# EAGLE schematic fatteningFarm (EAGLE 9.6.2)
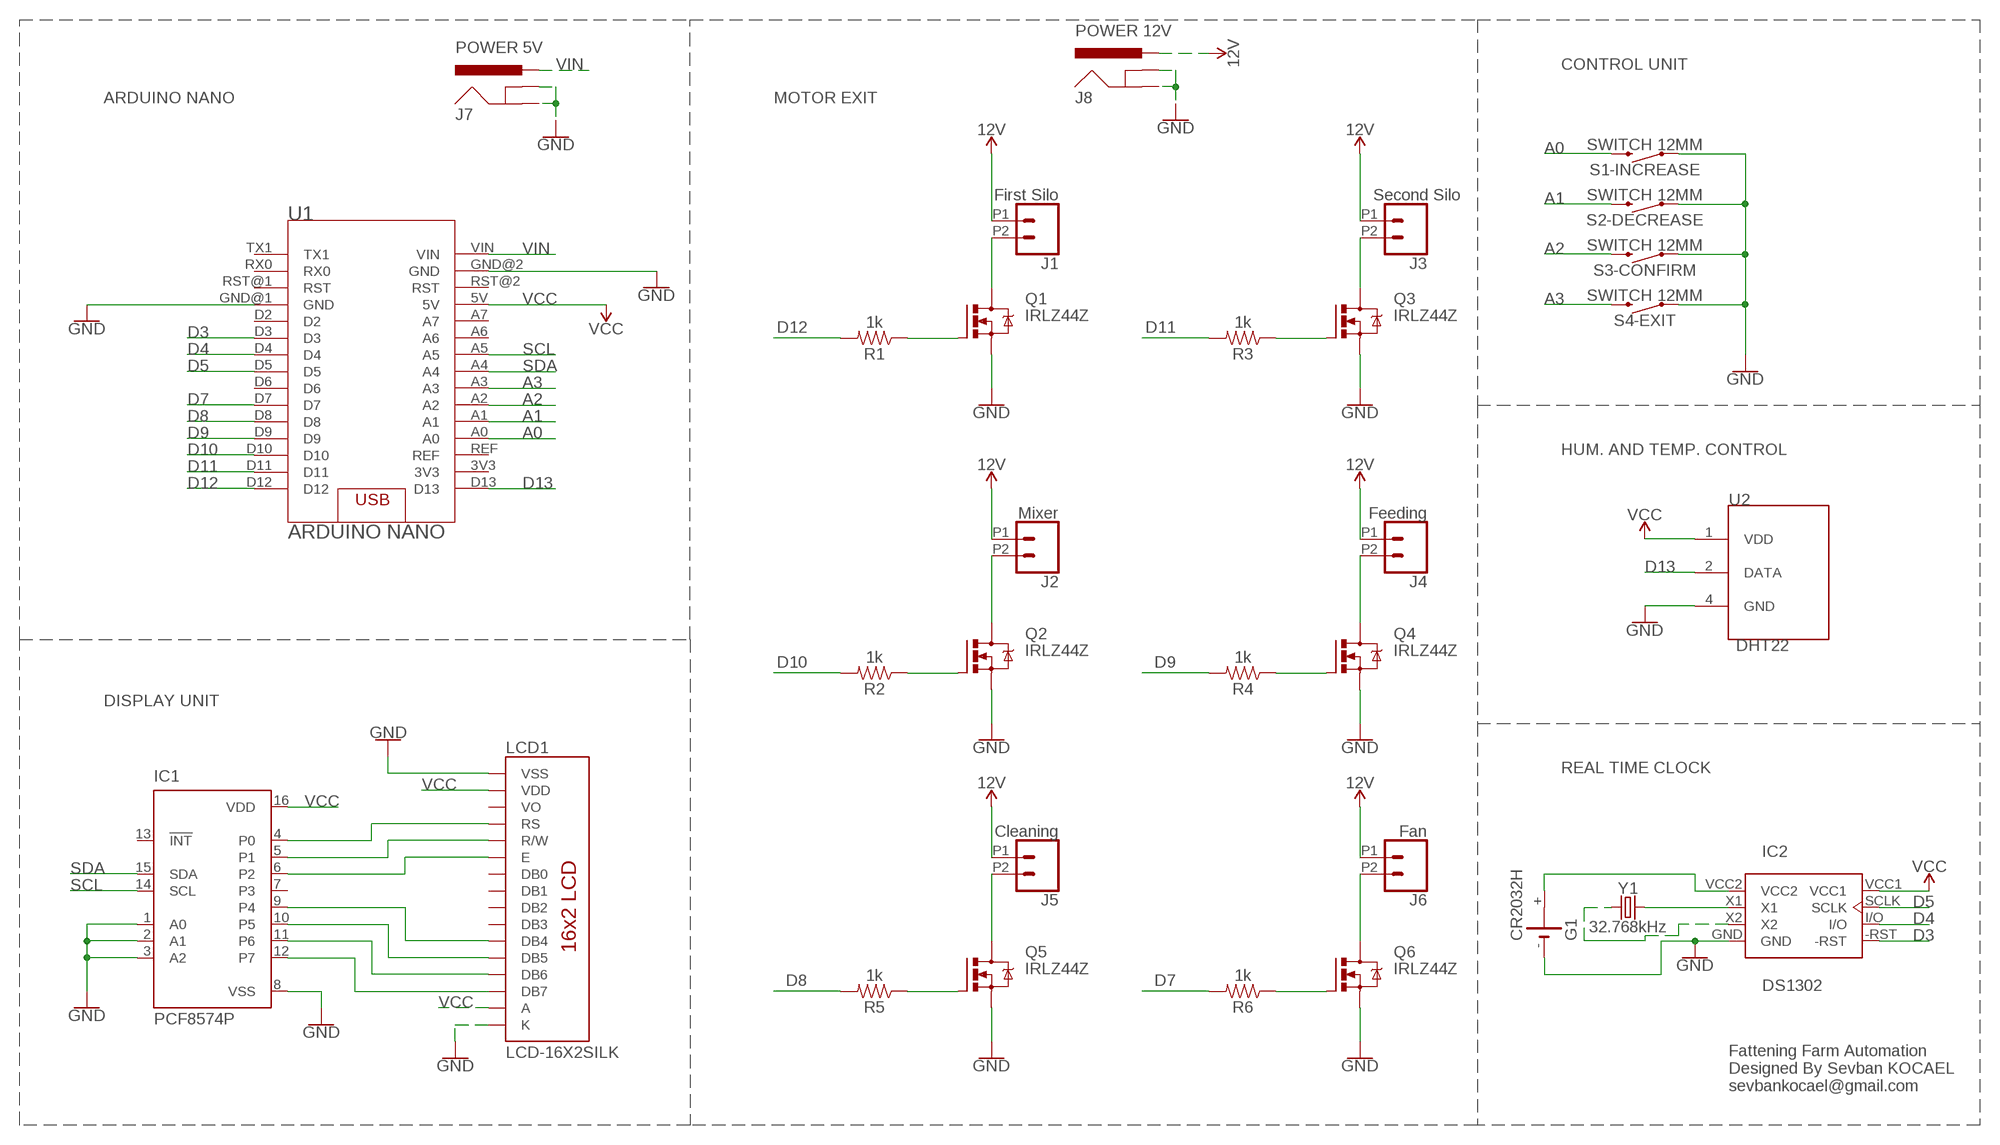
[diagram p0: schematic, sheet 1]

## Parts
G1  CR2032H  [CR2032H]
IC1  PCF8574P  [DIL16]
IC2  DS1302  [DIL08]
J1  First Silo  CONN_022.54MM_SCREWTERM  [1X02_2.54_SCREWTERM]
J2  Mixer  CONN_022.54MM_SCREWTERM  [1X02_2.54_SCREWTERM]
J3  Second Silo  CONN_022.54MM_SCREWTERM  [1X02_2.54_SCREWTERM]
J4  Feeding  CONN_022.54MM_SCREWTERM  [1X02_2.54_SCREWTERM]
J5  Cleaning  CONN_022.54MM_SCREWTERM  [1X02_2.54_SCREWTERM]
J6  Fan  CONN_022.54MM_SCREWTERM  [1X02_2.54_SCREWTERM]
J7  POWER 5V  POWER_JACK  [POWER_JACK_PTH]
J8  POWER 12V  POWER_JACK  [POWER_JACK_PTH]
LCD1  LCD-16X2SILK  [LCD-16X2]
Q1  IRLZ44Z  [TO220BH]
Q2  IRLZ44Z  [TO220BH]
Q3  IRLZ44Z  [TO220BH]
Q4  IRLZ44Z  [TO220BH]
Q5  IRLZ44Z  [TO220BH]
Q6  IRLZ44Z  [TO220BH]
R1  1k  1KOHM-HORIZ-1/4W-5%  [AXIAL-0.3]
R2  1k  1KOHM-HORIZ-1/4W-5%  [AXIAL-0.3]
R3  1k  1KOHM-HORIZ-1/4W-5%  [AXIAL-0.3]
R4  1k  1KOHM-HORIZ-1/4W-5%  [AXIAL-0.3]
R5  1k  1KOHM-HORIZ-1/4W-5%  [AXIAL-0.3]
R6  1k  1KOHM-HORIZ-1/4W-5%  [AXIAL-0.3]
S1-INCREASE  SWITCH 12MM  MOMENTARY-SWITCH-SPST-PTH-12MM  [TACTILE_SWITCH_PTH_12MM]
S2-DECREASE  SWITCH 12MM  MOMENTARY-SWITCH-SPST-PTH-12MM  [TACTILE_SWITCH_PTH_12MM]
S3-CONFIRM  SWITCH 12MM  MOMENTARY-SWITCH-SPST-PTH-12MM  [TACTILE_SWITCH_PTH_12MM]
S4-EXIT  SWITCH 12MM  MOMENTARY-SWITCH-SPST-PTH-12MM  [TACTILE_SWITCH_PTH_12MM]
U1  ARDUINO NANO  ARDUINO_NANO  [ARDUINO_NANO]
U2  DHT22  [DHT22]
Y1  32.768kHz  CRYSTAL-32.768KHZPTH-2X6  [CRYSTAL-PTH-2X6-CYL]

## Nets
12V: J1.P1 J2.P1 J3.P1 J4.P1 J5.P1 J6.P1 J8.PWR
A0: S1-INCREASE.3 U1.A0
A1: S2-DECREASE.3 U1.A1
A2: S3-CONFIRM.3 U1.A2
A3: S4-EXIT.3 U1.A3
D3: IC2.-RST U1.D3
D4: IC2.I/O U1.D4
D5: IC2.SCLK U1.D5
D7: R6.P$2 U1.D7
D8: R5.P$2 U1.D8
D9: R4.P$2 U1.D9
D10: R2.P$2 U1.D10
D11: R3.P$2 U1.D11
D12: R1.P$2 U1.D12
D13: U1.D13 U2.2(DATA)
GND: G1.- IC1.1(A0) IC1.2(A1) IC1.3(A2) IC1.8(VSS) IC2.GND J7.GND J7.GNDBREAK J8.GND J8.GNDBREAK LCD1.1(VSS) LCD1.16(K) Q1.S Q2.S Q3.S Q4.S Q5.S Q6.S S1-INCREASE.1 S2-DECREASE.1 S3-CONFIRM.1 S4-EXIT.1 U1.GND@1(GND) U1.GND@2(GND) U2.4(GND)
N$1: IC2.X1 Y1.1
N$2: Q1.G R1.P$1
N$7: J1.P2 Q1.D
N$8: IC1.4(P0) LCD1.4(RS)
N$9: IC2.X2 Y1.2
N$18: Q2.G R2.P$1
N$30: IC1.5(P1) LCD1.5(R/W)
N$31: IC1.6(P2) LCD1.6(E)
N$32: IC1.9(P4) LCD1.11(DB4)
N$33: IC1.10(P5) LCD1.12(DB5)
N$34: IC1.11(P6) LCD1.13(DB6)
N$35: IC1.12(P7) LCD1.14(DB7)
N$36: J2.P2 Q2.D
N$37: Q3.G R3.P$1
N$38: J3.P2 Q3.D
N$39: Q4.G R4.P$1
N$40: J4.P2 Q4.D
N$41: Q5.G R5.P$1
N$42: J5.P2 Q5.D
N$43: Q6.G R6.P$1
N$44: J6.P2 Q6.D
SCL: IC1.14(SCL) U1.A5
SDA: IC1.15(SDA) U1.A4
VCC: IC1.16(VDD) IC2.VCC1 LCD1.2(VDD) LCD1.15(A) U1.5V U2.1(VDD)
VCC2: G1.+ IC2.VCC2
VIN: J7.PWR U1.VIN
Unconnected: G1.+@1(+) IC1.7(P3) IC1.13(!INT) LCD1.3(VO) LCD1.7(DB0) LCD1.8(DB1) LCD1.9(DB2) LCD1.10(DB3) U1.3V3 U1.A6 U1.A7 U1.D2 U1.D6 U1.REF U1.RST@1(RST) U1.RST@2(RST) U1.RX0 U1.TX1

## Notes on the sheet
- CONTROL UNIT
- ARDUINO NANO | MOTOR EXIT
- HUM. AND TEMP. CONTROL
- DISPLAY UNIT
- REAL TIME CLOCK
- Fattening Farm Automation
  Designed By Sevban KOCAEL
  sevbankocael@gmail.com

## Library data of the parts
G1 = battery:CR2032H: LI BATTERY Varta
IC1 = micro-philips:PCF8574: I2C-Bus Remote 8-bit I/O expander http://www.semiconductors.philips.com/acrobat_download/datasheets/PCF8574_4.pdf; MPN: PCF8574PN; OC_FARNELL: 204020; OC_NEWARK: 11N8515
IC2 = DS1302:DS1302: Real-time clock (RTC) counts seconds, minutes hours, date of the month, month, day of the week, and year with leap-year compensation valid up to 2100
J1-J6 = SparkFun-Connectors:CONN_02: Multi connection point. Often used as Generic Header-pin footprint for 0.1 inch spaced/style header connections On any of the 0.1 inch spaced packages, you can populate with these: Break Away Headers - Straight <https://www.sparkfun.com/products/116> (PRT-00116) Break Away Male Headers - Right Angle <https://www.sparkfun.com/products/553> (PRT-00553) Female Headers <https://www.sparkfun.com/products/115> (PRT-00115) Break Away Headers - Machine Pin <https://www.sparkfun.com/products/117> (PRT-00117) Break Away Female Headers - Swiss Machine Pin <https://www.sparkfun.com/products/743> (PRT-00743) For SCREWTERMINALS and SPRING TERMINALS visit here: Screw Terimnals on SparkFun.com <https://www.sparkfun.com/search/results?term=Screw+Terminals> (5mm/3.5mm/2.54mm spacing) This device is also useful as a general connection point to wire up your design to another part of your project. Our various solder wires solder well into these plated through hole pads. Hook-Up Wire - Assortment (Stranded, 22 AWG) <https://www.sparkfun.com/products/11375> (PRT-11375) Hook-Up Wire - Assortment (Solid Core, 22 AWG) <https://www.sparkfun.com/products/11367> (PRT-11367) View the entire wire category on our website here <https://www.sparkfun.com/categories/141> Special notes: Molex polarized connector foot print use with: PRT-08233 with associated crimp pins and housings. 2.54_SCREWTERM for use with PRT-10571. 3.5mm Screw Terminal footprints for PRT-08084 5mm Screw Terminal footprints for use with PRT-08432
J7 J8 = SparkFun-Connectors:POWER_JACK: Power Jack Connector This is the standard 5.5mm barrel jack for power. The PTH is the most common, proven, reliable, footprint. The Slot footprint only works if the mill layer is transmitted to the PCB fab house so be warned. Here are the connectors we sell at SparkFun: DC Barrel Power Jack/Connector <https://www.sparkfun.com/products/119> (PRT-00119) DC Barrel Power Jack/Connector (SMD) <https://www.sparkfun.com/products/12748> (PRT-12748) DC Barrel Jack Adapter - Breadboard Compatible <https://www.sparkfun.com/products/10811> (PRT-10811) It is used on this SparkFun product (and many, many others): SparkFun RedBoard - Programmed with Arduino <https://www.sparkfun.com/products/12757> (DEV-12757) Also, if you need a mating power supply or connector, please check these out: Wall Adapter Power Supply - 9VDC 650mA <https://www.sparkfun.com/products/298> (TOL-00298) DC Barrel Jack Adapter - Male <https://www.sparkfun.com/products/10287> (PRT-10287); PROD_ID: CONN-08197
LCD1 = SparkFun-Displays:LCD-16X2: Standard text-only 16x2 parallel input LCD Basic 16 character by 2 line display. Typically utilizes the extremely common HD44780 parallel interface chipset SparkFun Products: Basic 16x2 Green <https://www.sparkfun.com/products/255> Basic 8x2 Green <https://www.sparkfun.com/products/11122>; PROD_ID: LCD-12633; SF_ID: LCD-00255
Q1-Q6 = transistor-power:IRLZ44Z: N-Channel HEXFET® Power MOSFET Logic Level AUTOMOTIVE MOSFET Source: http://www.irf.com/product-info/datasheets/data/irlz44zpbf.pdf
R1-R6 = SparkFun-Resistors:1KOHM: 1kΩ resistor A resistor is a passive two-terminal electrical component that implements electrical resistance as a circuit element. Resistors act to reduce current flow, and, at the same time, act to lower voltage levels within circuits. - Wikipedia; PROD_ID: RES-08380
S1-INCREASE S2-DECREASE S3-CONFIRM S4-EXIT = SparkFun-Switches:MOMENTARY-SWITCH-SPST: Momentary Switch (Pushbutton) - SPST Normally-open (NO) SPST momentary switches (buttons, pushbuttons). Variants PTH-12MM - 12mm square, through-hole Momentary Pushbutton Switch - 12mm Square <https://www.sparkfun.com/products/9190> (COM-09190) PTH-6.0MM, PTH-6.0MM-KIT - 6.0mm square, through-hole Mini Pushbutton Switch <https://www.sparkfun.com/products/97> (COM-00097) KIT package intended for soldering kit's - only one side of pads' copper is exposed. PTH-RIGHT-ANGLE-KIT - Right-angle, through-hole Right Angle Tactile Button <https://www.sparkfun.com/products/10791> - Used on SparkFun BigTime Watch Kit <https://www.sparkfun.com/products/11734> SMD-12MM - 12mm square, surface-mount Tactile Button - SMD (12mm) <https://www.sparkfun.com/products/12993> (COM-12993) Used on SparkFun PicoBoard <https://www.sparkfun.com/products/11888> SMD-4.5MM - 4.5mm Square Trackball Switch Used on SparkFun Blackberry Trackballer Breakout <https://www.sparkfun.com/products/13169> SMD-4.6MMX2.8MM - 4.60mm x 2.80mm, surface mount Used on SparkFun Pro Micro - RP2040 <https://www.sparkfun.com/products/17717> SMD-5.2MM, SMD-5.2-REDUNDANT - 5.2mm square, surface-mount Mini Pushbutton Switch - SMD <https://www.sparkfun.com/products/8720> (COM-08720) Used on Arduino Pro Mini <https://www.sparkfun.com/products/11114> REDUNDANT package connects both switch circuits together SMD-6.0X3.5MM - 6.0 x 3.5mm, surface mount Momentary Reset Switch SMD <https://www.sparkfun.com/products/8229> (COM-08229) SMD-6.2MM-TALL - 6.2mm square, surface mount Tactile Button - SMD (6mm) <https://www.sparkfun.com/products/12992> Used on SparkFun Digital Sandbox <https://www.sparkfun.com/products/12651> SMD-RIGHT-ANGLE - Right-angle, surface mount Used on SparkFun Block for Intel® Edison - Arduino <https://www.sparkfun.com/products/13036>; PROD_ID: SWCH-09185; SF_SKU: COM-09190
U1 = LezzetliRobotTarifleri:ARDUINO_NANO: ARDUINO NANO DEVICE
U2 = LezzetliRobotTarifleri:DHT22
Y1 = SparkFun-Clocks:CRYSTAL-32.768KHZ: 32.768kHz Crystal Frequency: 32.768kHz Frequency Stability: ±20ppm Load Capacitance: 12.5pF (PTH-2X6 & SMD-3.2X1.5), 6pF (SMD-2X6) SparkFun Products: SparkFun BigTime Watch Kit <https://www.sparkfun.com/products/11734> SparkFun nRF52832 Breakout <https://www.sparkfun.com/products/13990> SparkFun Real Time Clock Module <https://www.sparkfun.com/products/12708>; PROD_ID: XTAL-10112